# Altium schematic sheet LED_MATRIX.SchDoc: LED MATRIX
size A3; Author: Silvio Navaretti; CompanyName: ARDUINO; DrawnBy: Silvio Navaretti; Engineer: Silvio Navaretti; Organization: ARDUINO; SheetNumber: 40; SheetTotal: 41; RevAuthor: Silvio Navaretti
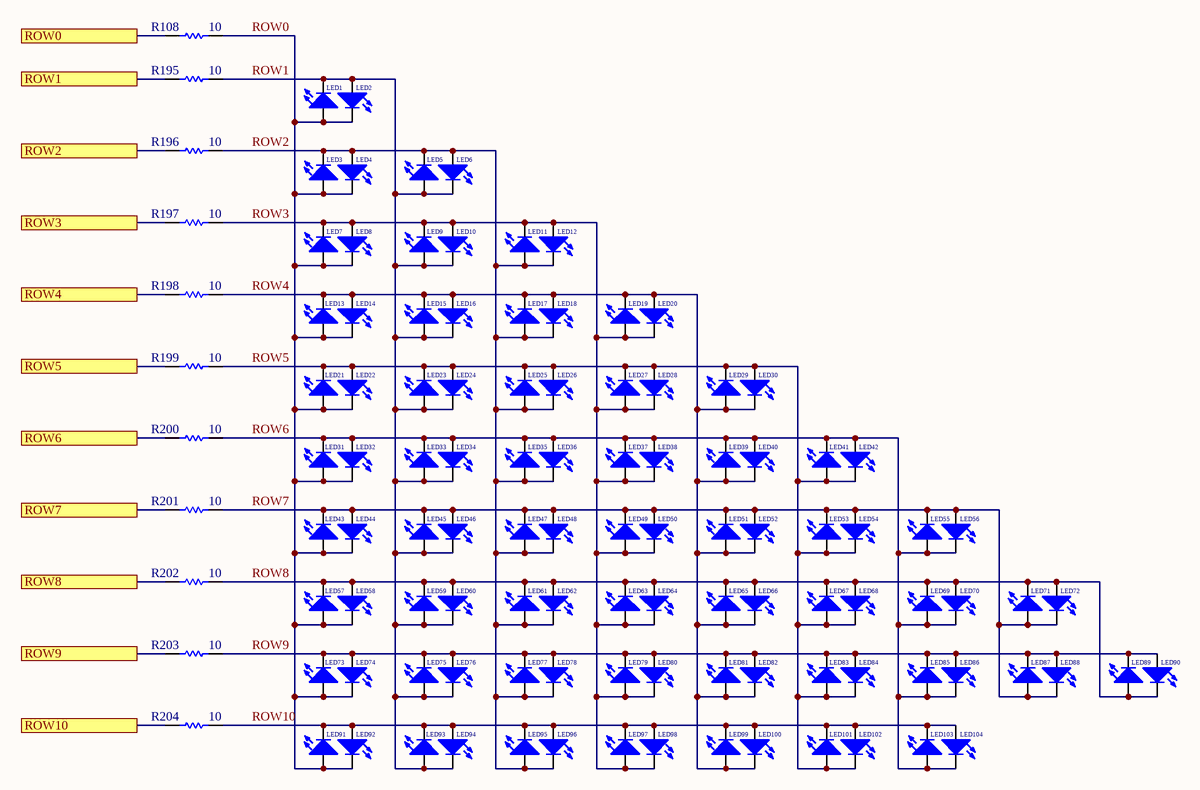
[diagram p0: LED_MATRIX.SchDoc]

## Parts
LED1  LTST-C191TBKT-5A  [LEDC1608X80N-AK]  (value not drawn)
LED2  LTST-C191TBKT-5A  [LEDC1608X80N-AK]  (value not drawn)
LED3  LTST-C191TBKT-5A  [LEDC1608X80N-AK]  (value not drawn)
LED4  LTST-C191TBKT-5A  [LEDC1608X80N-AK]  (value not drawn)
LED5  LTST-C191TBKT-5A  [LEDC1608X80N-AK]  (value not drawn)
LED6  LTST-C191TBKT-5A  [LEDC1608X80N-AK]  (value not drawn)
LED7  LTST-C191TBKT-5A  [LEDC1608X80N-AK]  (value not drawn)
LED8  LTST-C191TBKT-5A  [LEDC1608X80N-AK]  (value not drawn)
LED9  LTST-C191TBKT-5A  [LEDC1608X80N-AK]  (value not drawn)
LED10  LTST-C191TBKT-5A  [LEDC1608X80N-AK]  (value not drawn)
LED11  LTST-C191TBKT-5A  [LEDC1608X80N-AK]  (value not drawn)
LED12  LTST-C191TBKT-5A  [LEDC1608X80N-AK]  (value not drawn)
LED13  LTST-C191TBKT-5A  [LEDC1608X80N-AK]  (value not drawn)
LED14  LTST-C191TBKT-5A  [LEDC1608X80N-AK]  (value not drawn)
LED15  LTST-C191TBKT-5A  [LEDC1608X80N-AK]  (value not drawn)
LED16  LTST-C191TBKT-5A  [LEDC1608X80N-AK]  (value not drawn)
LED17  LTST-C191TBKT-5A  [LEDC1608X80N-AK]  (value not drawn)
LED18  LTST-C191TBKT-5A  [LEDC1608X80N-AK]  (value not drawn)
LED19  LTST-C191TBKT-5A  [LEDC1608X80N-AK]  (value not drawn)
LED20  LTST-C191TBKT-5A  [LEDC1608X80N-AK]  (value not drawn)
LED21  LTST-C191TBKT-5A  [LEDC1608X80N-AK]  (value not drawn)
LED22  LTST-C191TBKT-5A  [LEDC1608X80N-AK]  (value not drawn)
LED23  LTST-C191TBKT-5A  [LEDC1608X80N-AK]  (value not drawn)
LED24  LTST-C191TBKT-5A  [LEDC1608X80N-AK]  (value not drawn)
LED25  LTST-C191TBKT-5A  [LEDC1608X80N-AK]  (value not drawn)
LED26  LTST-C191TBKT-5A  [LEDC1608X80N-AK]  (value not drawn)
LED27  LTST-C191TBKT-5A  [LEDC1608X80N-AK]  (value not drawn)
LED28  LTST-C191TBKT-5A  [LEDC1608X80N-AK]  (value not drawn)
LED29  LTST-C191TBKT-5A  [LEDC1608X80N-AK]  (value not drawn)
LED30  LTST-C191TBKT-5A  [LEDC1608X80N-AK]  (value not drawn)
LED31  LTST-C191TBKT-5A  [LEDC1608X80N-AK]  (value not drawn)
LED32  LTST-C191TBKT-5A  [LEDC1608X80N-AK]  (value not drawn)
LED33  LTST-C191TBKT-5A  [LEDC1608X80N-AK]  (value not drawn)
LED34  LTST-C191TBKT-5A  [LEDC1608X80N-AK]  (value not drawn)
LED35  LTST-C191TBKT-5A  [LEDC1608X80N-AK]  (value not drawn)
LED36  LTST-C191TBKT-5A  [LEDC1608X80N-AK]  (value not drawn)
LED37  LTST-C191TBKT-5A  [LEDC1608X80N-AK]  (value not drawn)
LED38  LTST-C191TBKT-5A  [LEDC1608X80N-AK]  (value not drawn)
LED39  LTST-C191TBKT-5A  [LEDC1608X80N-AK]  (value not drawn)
LED40  LTST-C191TBKT-5A  [LEDC1608X80N-AK]  (value not drawn)
LED41  LTST-C191TBKT-5A  [LEDC1608X80N-AK]  (value not drawn)
LED42  LTST-C191TBKT-5A  [LEDC1608X80N-AK]  (value not drawn)
LED43  LTST-C191TBKT-5A  [LEDC1608X80N-AK]  (value not drawn)
LED44  LTST-C191TBKT-5A  [LEDC1608X80N-AK]  (value not drawn)
LED45  LTST-C191TBKT-5A  [LEDC1608X80N-AK]  (value not drawn)
LED46  LTST-C191TBKT-5A  [LEDC1608X80N-AK]  (value not drawn)
LED47  LTST-C191TBKT-5A  [LEDC1608X80N-AK]  (value not drawn)
LED48  LTST-C191TBKT-5A  [LEDC1608X80N-AK]  (value not drawn)
LED49  LTST-C191TBKT-5A  [LEDC1608X80N-AK]  (value not drawn)
LED50  LTST-C191TBKT-5A  [LEDC1608X80N-AK]  (value not drawn)
LED51  LTST-C191TBKT-5A  [LEDC1608X80N-AK]  (value not drawn)
LED52  LTST-C191TBKT-5A  [LEDC1608X80N-AK]  (value not drawn)
LED53  LTST-C191TBKT-5A  [LEDC1608X80N-AK]  (value not drawn)
LED54  LTST-C191TBKT-5A  [LEDC1608X80N-AK]  (value not drawn)
LED55  LTST-C191TBKT-5A  [LEDC1608X80N-AK]  (value not drawn)
LED56  LTST-C191TBKT-5A  [LEDC1608X80N-AK]  (value not drawn)
LED57  LTST-C191TBKT-5A  [LEDC1608X80N-AK]  (value not drawn)
LED58  LTST-C191TBKT-5A  [LEDC1608X80N-AK]  (value not drawn)
LED59  LTST-C191TBKT-5A  [LEDC1608X80N-AK]  (value not drawn)
LED60  LTST-C191TBKT-5A  [LEDC1608X80N-AK]  (value not drawn)
LED61  LTST-C191TBKT-5A  [LEDC1608X80N-AK]  (value not drawn)
LED62  LTST-C191TBKT-5A  [LEDC1608X80N-AK]  (value not drawn)
LED63  LTST-C191TBKT-5A  [LEDC1608X80N-AK]  (value not drawn)
LED64  LTST-C191TBKT-5A  [LEDC1608X80N-AK]  (value not drawn)
LED65  LTST-C191TBKT-5A  [LEDC1608X80N-AK]  (value not drawn)
LED66  LTST-C191TBKT-5A  [LEDC1608X80N-AK]  (value not drawn)
LED67  LTST-C191TBKT-5A  [LEDC1608X80N-AK]  (value not drawn)
LED68  LTST-C191TBKT-5A  [LEDC1608X80N-AK]  (value not drawn)
LED69  LTST-C191TBKT-5A  [LEDC1608X80N-AK]  (value not drawn)
LED70  LTST-C191TBKT-5A  [LEDC1608X80N-AK]  (value not drawn)
LED71  LTST-C191TBKT-5A  [LEDC1608X80N-AK]  (value not drawn)
LED72  LTST-C191TBKT-5A  [LEDC1608X80N-AK]  (value not drawn)
LED73  LTST-C191TBKT-5A  [LEDC1608X80N-AK]  (value not drawn)
LED74  LTST-C191TBKT-5A  [LEDC1608X80N-AK]  (value not drawn)
LED75  LTST-C191TBKT-5A  [LEDC1608X80N-AK]  (value not drawn)
LED76  LTST-C191TBKT-5A  [LEDC1608X80N-AK]  (value not drawn)
LED77  LTST-C191TBKT-5A  [LEDC1608X80N-AK]  (value not drawn)
LED78  LTST-C191TBKT-5A  [LEDC1608X80N-AK]  (value not drawn)
LED79  LTST-C191TBKT-5A  [LEDC1608X80N-AK]  (value not drawn)
LED80  LTST-C191TBKT-5A  [LEDC1608X80N-AK]  (value not drawn)
LED81  LTST-C191TBKT-5A  [LEDC1608X80N-AK]  (value not drawn)
LED82  LTST-C191TBKT-5A  [LEDC1608X80N-AK]  (value not drawn)
LED83  LTST-C191TBKT-5A  [LEDC1608X80N-AK]  (value not drawn)
LED84  LTST-C191TBKT-5A  [LEDC1608X80N-AK]  (value not drawn)
LED85  LTST-C191TBKT-5A  [LEDC1608X80N-AK]  (value not drawn)
LED86  LTST-C191TBKT-5A  [LEDC1608X80N-AK]  (value not drawn)
LED87  LTST-C191TBKT-5A  [LEDC1608X80N-AK]  (value not drawn)
LED88  LTST-C191TBKT-5A  [LEDC1608X80N-AK]  (value not drawn)
LED89  LTST-C191TBKT-5A  [LEDC1608X80N-AK]  (value not drawn)
LED90  LTST-C191TBKT-5A  [LEDC1608X80N-AK]  (value not drawn)
LED91  LTST-C191TBKT-5A  [LEDC1608X80N-AK]  (value not drawn)
LED92  LTST-C191TBKT-5A  [LEDC1608X80N-AK]  (value not drawn)
LED93  LTST-C191TBKT-5A  [LEDC1608X80N-AK]  (value not drawn)
LED94  LTST-C191TBKT-5A  [LEDC1608X80N-AK]  (value not drawn)
LED95  LTST-C191TBKT-5A  [LEDC1608X80N-AK]  (value not drawn)
LED96  LTST-C191TBKT-5A  [LEDC1608X80N-AK]  (value not drawn)
LED97  LTST-C191TBKT-5A  [LEDC1608X80N-AK]  (value not drawn)
LED98  LTST-C191TBKT-5A  [LEDC1608X80N-AK]  (value not drawn)
LED99  LTST-C191TBKT-5A  [LEDC1608X80N-AK]  (value not drawn)
LED100  LTST-C191TBKT-5A  [LEDC1608X80N-AK]  (value not drawn)
LED101  LTST-C191TBKT-5A  [LEDC1608X80N-AK]  (value not drawn)
LED102  LTST-C191TBKT-5A  [LEDC1608X80N-AK]  (value not drawn)
LED103  LTST-C191TBKT-5A  [LEDC1608X80N-AK]  (value not drawn)
LED104  LTST-C191TBKT-5A  [LEDC1608X80N-AK]  (value not drawn)
R108  value 10  [RES-0402]  (hidden comment: RC0402FR-0710RL)
R195  value 10  [RES-0402]  (hidden comment: RC0402FR-0710RL)
R196  value 10  [RES-0402]  (hidden comment: RC0402FR-0710RL)
R197  value 10  [RES-0402]  (hidden comment: RC0402FR-0710RL)
R198  value 10  [RES-0402]  (hidden comment: RC0402FR-0710RL)
R199  value 10  [RES-0402]  (hidden comment: RC0402FR-0710RL)
R200  value 10  [RES-0402]  (hidden comment: RC0402FR-0710RL)
R201  value 10  [RES-0402]  (hidden comment: RC0402FR-0710RL)
R202  value 10  [RES-0402]  (hidden comment: RC0402FR-0710RL)
R203  value 10  [RES-0402]  (hidden comment: RC0402FR-0710RL)
R204  value 10  [RES-0402]  (hidden comment: RC0402FR-0710RL)

## Ports
ROW0, ROW1, ROW2, ROW3, ROW4, ROW5, ROW6, ROW7, ROW8, ROW9, ROW10

## Nets
ROW0: LED1.A LED2.C LED3.A LED4.C LED7.A LED8.C LED13.A LED14.C LED21.A LED22.C LED31.A LED32.C LED43.A LED44.C LED57.A LED58.C LED73.A LED74.C LED91.A LED92.C R108.1
ROW0: R108.2 ; port ROW0  [a separate net that carries the same name]
ROW1: LED1.C LED2.A LED5.A LED6.C LED9.A LED10.C LED15.A LED16.C LED23.A LED24.C LED33.A LED34.C LED45.A LED46.C LED59.A LED60.C LED75.A LED76.C LED93.A LED94.C R195.1
ROW1: R195.2 ; port ROW1  [a separate net that carries the same name]
ROW2: LED3.C LED4.A LED5.C LED6.A LED11.A LED12.C LED17.A LED18.C LED25.A LED26.C LED35.A LED36.C LED47.A LED48.C LED61.A LED62.C LED77.A LED78.C LED95.A LED96.C R196.1
ROW2: R196.2 ; port ROW2  [a separate net that carries the same name]
ROW3: LED7.C LED8.A LED9.C LED10.A LED11.C LED12.A LED19.A LED20.C LED27.A LED28.C LED37.A LED38.C LED49.A LED50.C LED63.A LED64.C LED79.A LED80.C LED97.A LED98.C R197.1
ROW3: R197.2 ; port ROW3  [a separate net that carries the same name]
ROW4: LED13.C LED14.A LED15.C LED16.A LED17.C LED18.A LED19.C LED20.A LED29.A LED30.C LED39.A LED40.C LED51.A LED52.C LED65.A LED66.C LED81.A LED82.C LED99.A LED100.C R198.1
ROW4: R198.2 ; port ROW4  [a separate net that carries the same name]
ROW5: LED21.C LED22.A LED23.C LED24.A LED25.C LED26.A LED27.C LED28.A LED29.C LED30.A LED41.A LED42.C LED53.A LED54.C LED67.A LED68.C LED83.A LED84.C LED101.A LED102.C R199.1
ROW5: R199.2 ; port ROW5  [a separate net that carries the same name]
ROW6: LED31.C LED32.A LED33.C LED34.A LED35.C LED36.A LED37.C LED38.A LED39.C LED40.A LED41.C LED42.A LED55.A LED56.C LED69.A LED70.C LED85.A LED86.C LED103.A LED104.C R200.1
ROW6: R200.2 ; port ROW6  [a separate net that carries the same name]
ROW7: LED43.C LED44.A LED45.C LED46.A LED47.C LED48.A LED49.C LED50.A LED51.C LED52.A LED53.C LED54.A LED55.C LED56.A LED71.A LED72.C LED87.A LED88.C R201.1
ROW7: R201.2 ; port ROW7  [a separate net that carries the same name]
ROW8: R202.2 ; port ROW8
ROW8: LED57.C LED58.A LED59.C LED60.A LED61.C LED62.A LED63.C LED64.A LED65.C LED66.A LED67.C LED68.A LED69.C LED70.A LED71.C LED72.A LED89.A LED90.C R202.1  [a separate net that carries the same name]
ROW9: LED73.C LED74.A LED75.C LED76.A LED77.C LED78.A LED79.C LED80.A LED81.C LED82.A LED83.C LED84.A LED85.C LED86.A LED87.C LED88.A LED89.C LED90.A R203.1
ROW9: R203.2 ; port ROW9  [a separate net that carries the same name]
ROW10: LED91.C LED92.A LED93.C LED94.A LED95.C LED96.A LED97.C LED98.A LED99.C LED100.A LED101.C LED102.A LED103.C LED104.A R204.1
ROW10: R204.2 ; port ROW10  [a separate net that carries the same name]

## Notes on the sheet
- Title:
- ID:
- Date:
- Time:
- Version:
- Sheet
- of
- RevAuthor:
- Reference Designs ARE PROVIDED "AS IS" AND "WITH ALL FAULTS. Arduino SA DISCLAIMS ALL OTHER WARRANTIES, EXPRESS OR IMPLIED, REGARDING PRODUCTS, INCLUDING BUT NOT LIMITED TO, ANY IMPLIED WARRANTIES OF MERCHANTABILITY OR FITNESS FOR A PARTICULAR PURPOSE.
  Arduino SA may make changes to specifications and product descriptions at any time, without notice. The Customer must not rely on the absence or characteristics of any features or instructions marked "reserved" or "undefined".
  Arduino SA reserves these for future definition and shall have no responsibility whatsoever for conflicts or incompatibilities arising from future changes to them. The product information on the Web Site or Materials is subject to change without notice.
  Do not finalize a design with this info. ARDUINO and other Arduino brands and logos and Trademarks of Arduino SA. All Arduino SA Trademarks cannot be used without owner's formal permission.
- File:
- Author:

## Library data of the parts
LED1-LED104 = L0040-A.2: LED SMD 0603 BLUE 468nm, water clear, 11-45 mcd, 138 deg; Manufacturer: Liteon; Code Arduino: L0040; Part Number: LTST-C191TBKT-5A
R108 R195-R204 = R0170-A.23: RES CHIP 0402 10R 1% 1/16W; Manufacturer: YAGEO; Code Arduino: R0170; Power: 62.5mW; Temperature coefficient: 200ppm; Part Number: RC0402FR-0710RL; Tolerance: 1%; Case Code (Imperial): 0402; Technology: Thick film